# Altium schematic sheet BMS_Slave_Top.SchDoc
size E
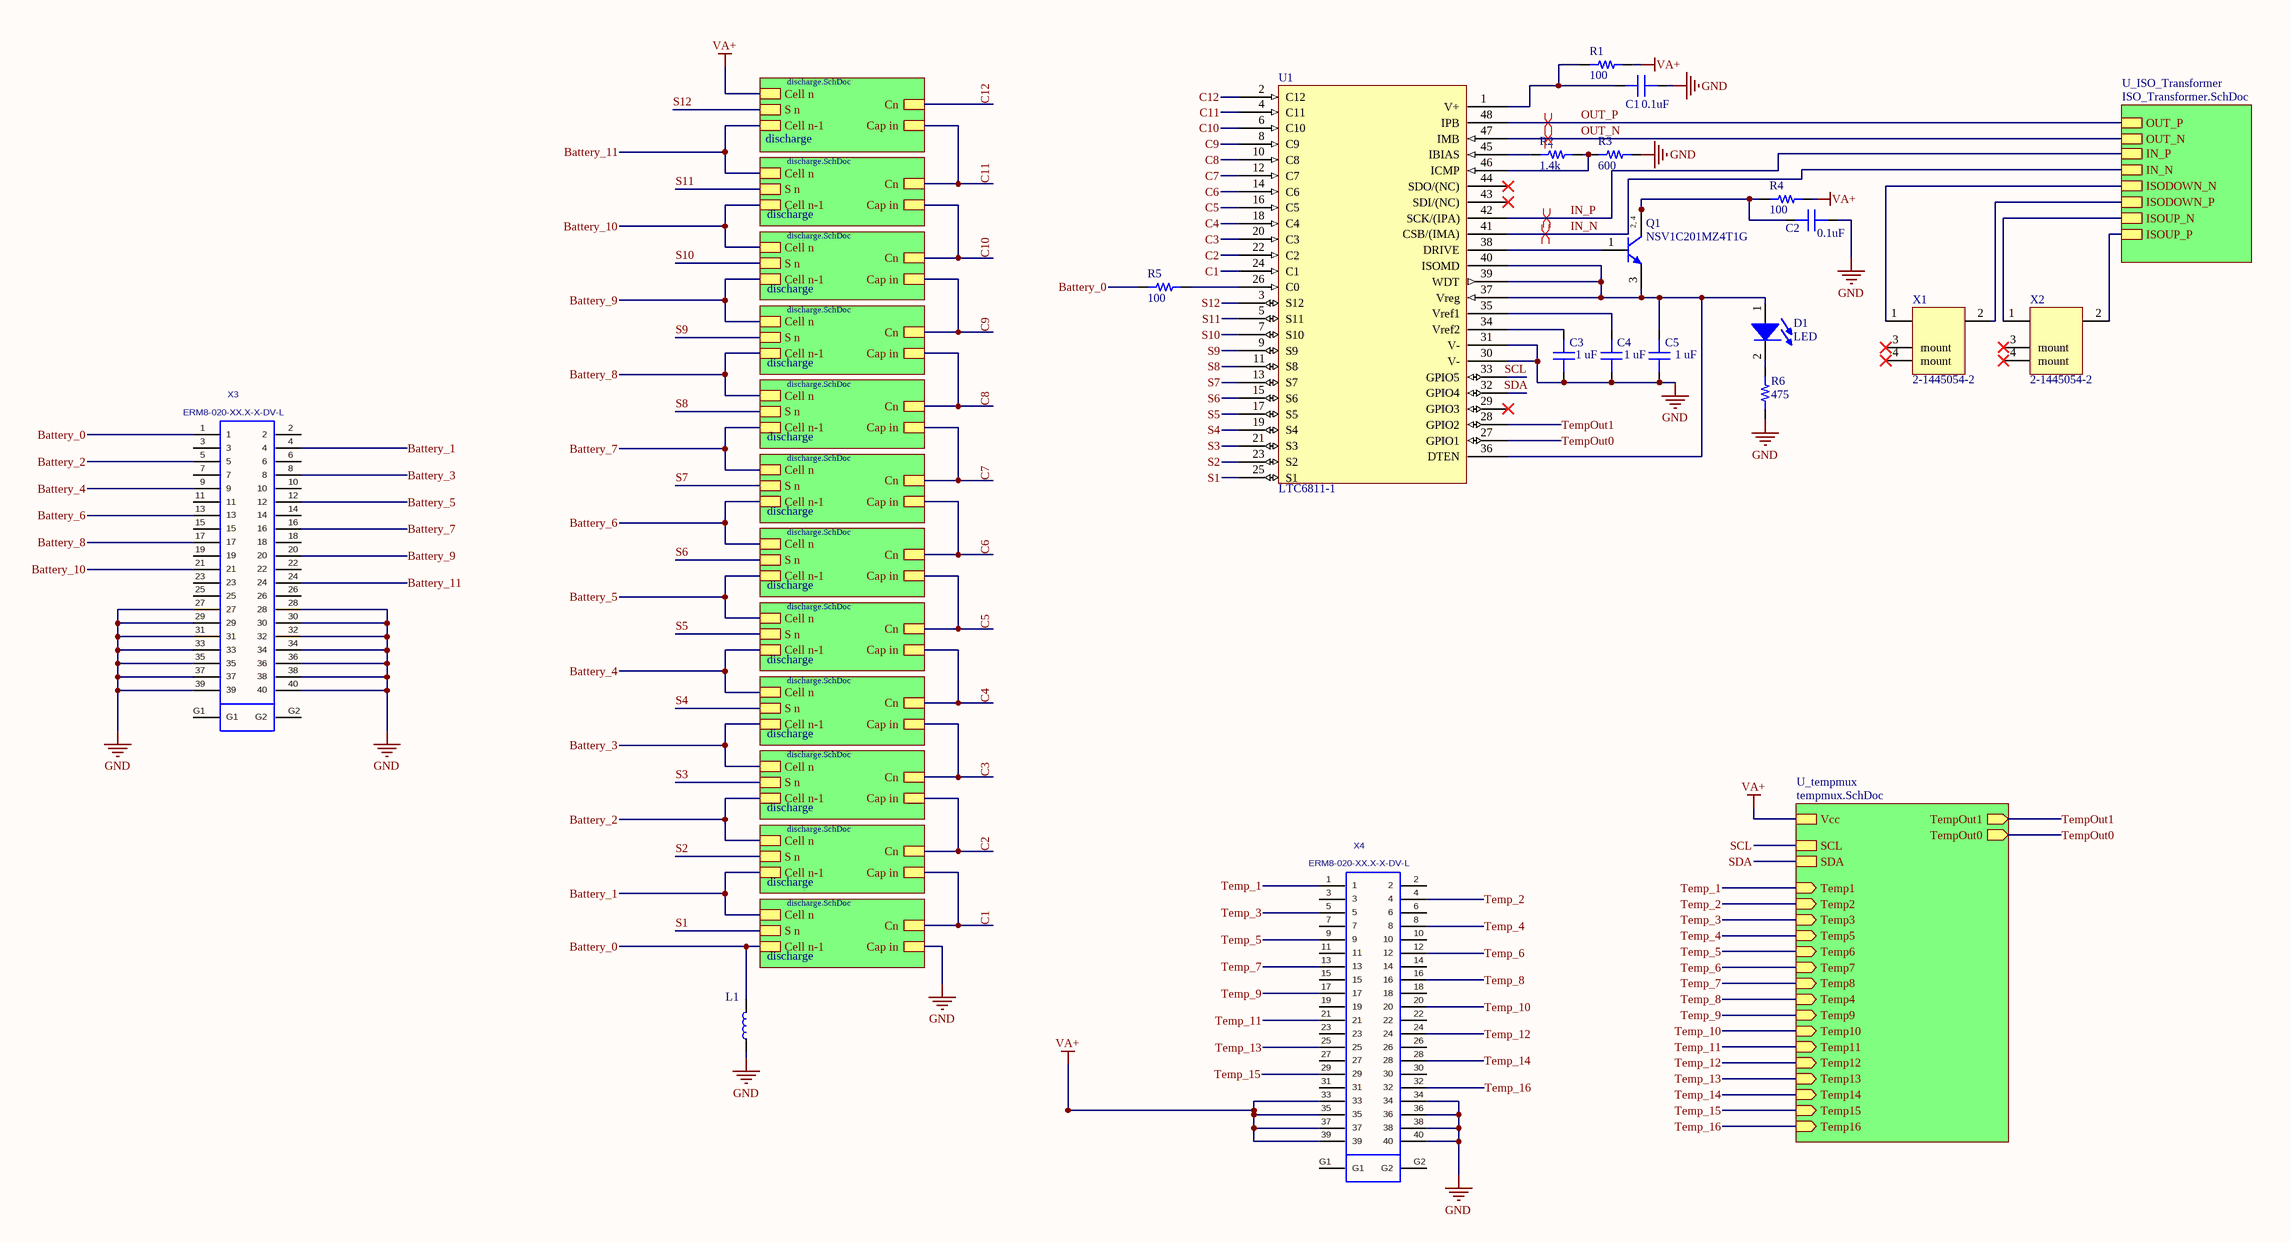
[diagram p0: BMS_Slave_Top.SchDoc]

## Parts
C1  capacitance: 0.1uF  [0603]  (hidden comment: capacitor)
C2  capacitance: 0.1uF  [0603]  (hidden comment: capacitor)
C3  capacitance: 1 uF  [0603]  (hidden comment: capacitor)
C4  capacitance: 1 uF  [0603]  (hidden comment: capacitor)
C5  capacitance: 1 uF  [0603]  (hidden comment: capacitor)
D1  LED  [0805_LED]
L1  MPZ1608S221ATA00  [0603]  (value not drawn)
Q1  NSV1C201MZ4T1G  [ONSC-SOT-223-4-318E-04_V]
R1  100  [RES 0603/1608]
R2  1.4k  [RES 0603/1608]
R3  600  [RES 0603/1608]
R4  100  [RES 0603/1608]
R5  100  [RES 0603/1608]
R6  475  [RES 0603/1608]
U1  LTC6811-1  [LTC6811-1]
X1  2-1445054-2  [2-1445054-2]
X2  2-1445054-2  [2-1445054-2]
X3  ERM8-020-XX.X-X-DV-L  [ERM8-020-XX.X-X-DV-L]
X4  ERM8-020-XX.X-X-DV-L  [ERM8-020-XX.X-X-DV-L]

## Sub-sheets
discharge = discharge.SchDoc: S n, Cap in, Cn, Cell n-1, Cell n
discharge = discharge.SchDoc: S n, Cap in, Cn, Cell n-1, Cell n
discharge = discharge.SchDoc: S n, Cap in, Cn, Cell n-1, Cell n
discharge = discharge.SchDoc: S n, Cap in, Cn, Cell n-1, Cell n
discharge = discharge.SchDoc: S n, Cap in, Cn, Cell n-1, Cell n
discharge = discharge.SchDoc: S n, Cap in, Cn, Cell n-1, Cell n
discharge = discharge.SchDoc: S n, Cap in, Cn, Cell n-1, Cell n
discharge = discharge.SchDoc: S n, Cap in, Cn, Cell n-1, Cell n
discharge = discharge.SchDoc: S n, Cap in, Cn, Cell n-1, Cell n
discharge = discharge.SchDoc: S n, Cap in, Cn, Cell n-1, Cell n
discharge = discharge.SchDoc: S n, Cap in, Cn, Cell n-1, Cell n
discharge = discharge.SchDoc: S n, Cap in, Cn, Cell n-1, Cell n
U_ISO_Transformer = ISO_Transformer.SchDoc: OUT_P, OUT_N, IN_P, IN_N, ISODOWN_P, ISODOWN_N, ISOUP_P, ISOUP_N
U_tempmux = tempmux.SchDoc: Vcc, SCL, SDA, TempOut1 (out), TempOut0 (out), Temp1 (in), Temp2 (in), Temp3 (in), Temp5 (in), Temp6 (in), Temp7 (in), Temp8 (in), Temp4 (in), Temp9 (in), Temp10 (in), Temp11 (in), Temp12 (in), Temp13 (in), Temp14 (in), Temp15 (in), Temp16 (in)

## Nets
GND: C1.1 C2.1 C3.1 C4.1 C5.1 L1.1 R3.2 R6.1 U1.30(V-) U1.31(V-) X3.27 X3.28 X3.29 X3.30 X3.31 X3.32 X3.33 X3.34 X3.35 X3.36 X3.37 X3.38 X3.39 X3.40 X4.34 X4.36 X4.38 X4.40 ; sheet discharge/Cap in
VA+: R1.1 R4.1 X4.33 X4.35 X4.37 X4.39 ; sheet discharge/Cell n, sheet U_tempmux/Vcc
Battery_0: L1.2 R5.1 X3.1 ; sheet discharge/Cell n-1
Battery_1: X3.4 ; sheet discharge/Cell n-1, sheet discharge/Cell n
Battery_2: X3.5 ; sheet discharge/Cell n-1, sheet discharge/Cell n
Battery_3: X3.8 ; sheet discharge/Cell n-1, sheet discharge/Cell n
Battery_4: X3.9 ; sheet discharge/Cell n-1, sheet discharge/Cell n
Battery_5: X3.12 ; sheet discharge/Cell n-1, sheet discharge/Cell n
Battery_6: X3.13 ; sheet discharge/Cell n-1, sheet discharge/Cell n
Battery_7: X3.16 ; sheet discharge/Cell n-1, sheet discharge/Cell n
Battery_8: X3.17 ; sheet discharge/Cell n-1, sheet discharge/Cell n
Battery_9: X3.20 ; sheet discharge/Cell n-1, sheet discharge/Cell n
Battery_10: X3.21 ; sheet discharge/Cell n-1, sheet discharge/Cell n
Battery_11: X3.24 ; sheet discharge/Cell n-1, sheet discharge/Cell n
C1: U1.24(C1) ; sheet discharge/Cap in, sheet discharge/Cn
C2: U1.22(C2) ; sheet discharge/Cap in, sheet discharge/Cn
C3: U1.20(C3) ; sheet discharge/Cap in, sheet discharge/Cn
C4: U1.18(C4) ; sheet discharge/Cap in, sheet discharge/Cn
C5: U1.16(C5) ; sheet discharge/Cap in, sheet discharge/Cn
C6: U1.14(C6) ; sheet discharge/Cap in, sheet discharge/Cn
C7: U1.12(C7) ; sheet discharge/Cap in, sheet discharge/Cn
C8: U1.10(C8) ; sheet discharge/Cap in, sheet discharge/Cn
C9: U1.8(C9) ; sheet discharge/Cap in, sheet discharge/Cn
C10: U1.6(C10) ; sheet discharge/Cap in, sheet discharge/Cn
C11: U1.4(C11) ; sheet discharge/Cap in, sheet discharge/Cn
C12: U1.2(C12) ; sheet discharge/Cn
IN_N: U1.41(CSB/(IMA)) ; sheet U_ISO_Transformer/IN_N
IN_P: U1.42(SCK/(IPA)) ; sheet U_ISO_Transformer/IN_P
OUT_N: U1.47(IMB) ; sheet U_ISO_Transformer/OUT_N
OUT_P: U1.48(IPB) ; sheet U_ISO_Transformer/OUT_P
S1: U1.25(S1) ; sheet discharge/S n
S2: U1.23(S2) ; sheet discharge/S n
S3: U1.21(S3) ; sheet discharge/S n
S4: U1.19(S4) ; sheet discharge/S n
S5: U1.17(S5) ; sheet discharge/S n
S6: U1.15(S6) ; sheet discharge/S n
S7: U1.13(S7) ; sheet discharge/S n
S8: U1.11(S8) ; sheet discharge/S n
S9: U1.9(S9) ; sheet discharge/S n
S10: U1.7(S10) ; sheet discharge/S n
S11: U1.5(S11) ; sheet discharge/S n
S12: U1.3(S12) ; sheet discharge/S n
SCL: U1.33(GPIO5) ; sheet U_tempmux/SCL
SDA: U1.32(GPIO4) ; sheet U_tempmux/SDA
Temp_1: X4.1 ; sheet U_tempmux/Temp1
Temp_2: X4.4 ; sheet U_tempmux/Temp2
Temp_3: X4.5 ; sheet U_tempmux/Temp3
Temp_4: X4.8 ; sheet U_tempmux/Temp5
Temp_5: X4.9 ; sheet U_tempmux/Temp6
Temp_6: X4.12 ; sheet U_tempmux/Temp7
Temp_7: X4.13 ; sheet U_tempmux/Temp8
Temp_8: X4.16 ; sheet U_tempmux/Temp4
Temp_9: X4.17 ; sheet U_tempmux/Temp9
Temp_10: X4.20 ; sheet U_tempmux/Temp10
Temp_11: X4.21 ; sheet U_tempmux/Temp11
Temp_12: X4.24 ; sheet U_tempmux/Temp12
Temp_13: X4.25 ; sheet U_tempmux/Temp13
Temp_14: X4.28 ; sheet U_tempmux/Temp14
Temp_15: X4.29 ; sheet U_tempmux/Temp15
Temp_16: X4.32 ; sheet U_tempmux/Temp16
TempOut0: U1.27(GPIO1) ; sheet U_tempmux/TempOut0
TempOut1: U1.28(GPIO2) ; sheet U_tempmux/TempOut1
NetC1_2: C1.2 R1.2 U1.1(V+)
NetC2_2: C2.2 Q1.2(C) Q1.4(C) R4.2
NetC3_2: C3.2 U1.34(Vref2)
NetC4_2: C4.2 U1.35(Vref1)
NetC5_2: C5.2 D1.1(A) Q1.3(E) U1.36(DTEN) U1.37(Vreg) U1.39(WDT) U1.40(ISOMD)
NetD1_2: D1.2(K) R6.2
NetQ1_1: Q1.1(B) U1.38(DRIVE)
NetR2_1: R2.1 U1.45(IBIAS)
NetR2_2: R2.2 R3.1 U1.46(ICMP)
NetR5_2: R5.2 U1.26(C0)
NetX1_1: X1.1 ; sheet U_ISO_Transformer/ISODOWN_N
NetX1_2: X1.2 ; sheet U_ISO_Transformer/ISODOWN_P
NetX2_1: X2.1 ; sheet U_ISO_Transformer/ISOUP_N
NetX2_2: X2.2 ; sheet U_ISO_Transformer/ISOUP_P

Not connected (* = marked no-connect by the designer): U1 29(GPIO3)* 43(SDI/(NC))* 44(SDO/(NC))*; X1 3(mount)* 4(mount)*; X2 3(mount)* 4(mount)*; X3 2 3 6 7 10 11 14 15 18 19 22 23 25 26 G1 G2; X4 2 3 6 7 10 11 14 15 18 19 22 23 26 27 30 31 G1 G2

## Layout directives
differential pair: IN_N, IN_P, OUT_N, OUT_P

## Notes on the sheet
- (in symbol 11) 2, 4

## Library data of the parts
C1-C5 = 1: Generic 0603 capacitor; id: 1; voltage: 50; dielectric: Ceramic; percent tolerance: 10; name: 0603 Capacitor; ESR: 1; package: 0603; quantity: 0
D1 = 19: Generic 0805 LED; id: 19; vr: 1; name: 0805 LED; numcircuits: 1; package: 0805; quantity: 0
L1 = 10: 220 Ohms @ 100MHz 1 Power Line Ferrite Bead 0; MF: TDK; id: 10; imax: 2.20000004768372; tolerance: 0; resistance: 50mOhm; MP: MPZ1608S221ATA00; SnapEDA_Link: https://www.snapeda.com/parts/MPZ1608S221ATA00/TDK-Lambda%20Americas%20Inc/view-part/?ref=snap; Digi-Key_Part_Number: 445-1565-1-ND; Digi-Key_Purchase_URL: https://www.digikey.com/product-detail/en/tdk-corporation/MPZ1608S221ATA00/445-1565-1-ND/571895?utm_source=snapeda&utm_medium=aggregator&utm_campaign=symbol; Package: 0603; Value: *; name: MPZ1608S221ATA00; quantity: 0; link: https://www.digikey.com/product-detail/en/tdk-corporation/MPZ1608S221ATA00/445-1565-1-ND/571895; createdby: Kevin
Q1 = 11: Manufacturer: On Semiconductor; IC Continuous (A): 2; Note1: 0; Polarity: NPN; Packing: Tape and Reel; id: 11; beta: 360; vcemax: 0.180000007152557; PackageReference: SOT-223-4-318E-04; ComponentLink3URL: http://www.onsemi.com/pub_link/Collateral/318E-04.PDF; RoHS: TRUE; PackageDescription: 4-Pin Small Outline Transistor, Body 6.5 x 3.5 mm, Pitch 2.3 mm; DatasheetVersion: Rev. 4; Mounting Technology: Surface Mount; ComponentLink1Description: Manufacturer URL; ComponentLink1URL: http://www.onsemi.com/; PackageVersion: Rev. N, 08/2009; ComponentLink2Description: Datasheet; ComponentLink2URL: http://www.onsemi.cn/pub_link/Collateral/NSS1C201MZ4-D.PDF; ComponentLink3Description: Package Specification; PartNumber: NSV1C201MZ4T1G; name: NSV1C201MZ4T1G; type: NPN; ic: 2; package: SOT-223; quantity: 0; link: https://www.mouser.com/datasheet/2/308/NSS1C201MZ4-D-356308.pdf; createdby: J.Childers; createddate: 10/5/2019 9:17:00 AM
R1-R6 = 1: id: 1; name: 0603 Resistor; percent tolerance: 5; package: 0603; quantity: 0
  R1 R4 R5: resistance: 100
  R2: resistance: 1.4k
  R3: resistance: 600
  R6: resistance: 475
U1 = 37: id: 37; vcc: 40; voltageinmax: 55; name: LTC6811-1; package: SSOP; quantity: 0; link: https://www.analog.com/media/en/technical-documentation/data-sheets/68111fb.pdf
X1 X2 = 16: Micro MATE-N-LOK 1x2; id: 16; numcontacts: 2; numrows: 1; name: 2-1445054-2; quantity: 0; link: https://www.digikey.com/products/en?keywords=2-1445054-2
X3 X4 = 34: MANUFACTURER: SAMTEC; id: 34; numcontacts: 40; numrows: 2; CREATED: August 17, 2016 - Wendy Xin; PCB DECAL: ERM8-020-XX.X-X-DV-L; name: ERM8-020-XX.X-X-DV-L; quantity: 0